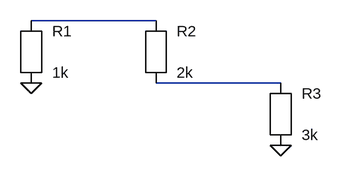
[diagram p0: schematic unlabelled_nets.asc]
unlabelled_nets.asc, the LTspice schematic file:
Version 4
SHEET 1 880 680
WIRE 96 96 288 96
WIRE 288 192 480 192
SYMBOL res 96 144 R0
SYMATTR InstName R1
SYMATTR Value 1k
SYMBOL res 288 144 R0
SYMATTR InstName R2
SYMATTR Value 2k
SYMBOL res 480 240 R0
SYMATTR InstName R3
SYMATTR Value 3k
FLAG 96 192 0
FLAG 480 288 0

The netlist it stands for:
* unlabelled_nets.asc
R1 N001 0 1k
R2 N001 N002 2k
R3 N002 0 3k
.backanno
.end